# EAGLE schematic OOBD-Cup_v6 (EAGLE 6.4)

## Sheet 1 of 3
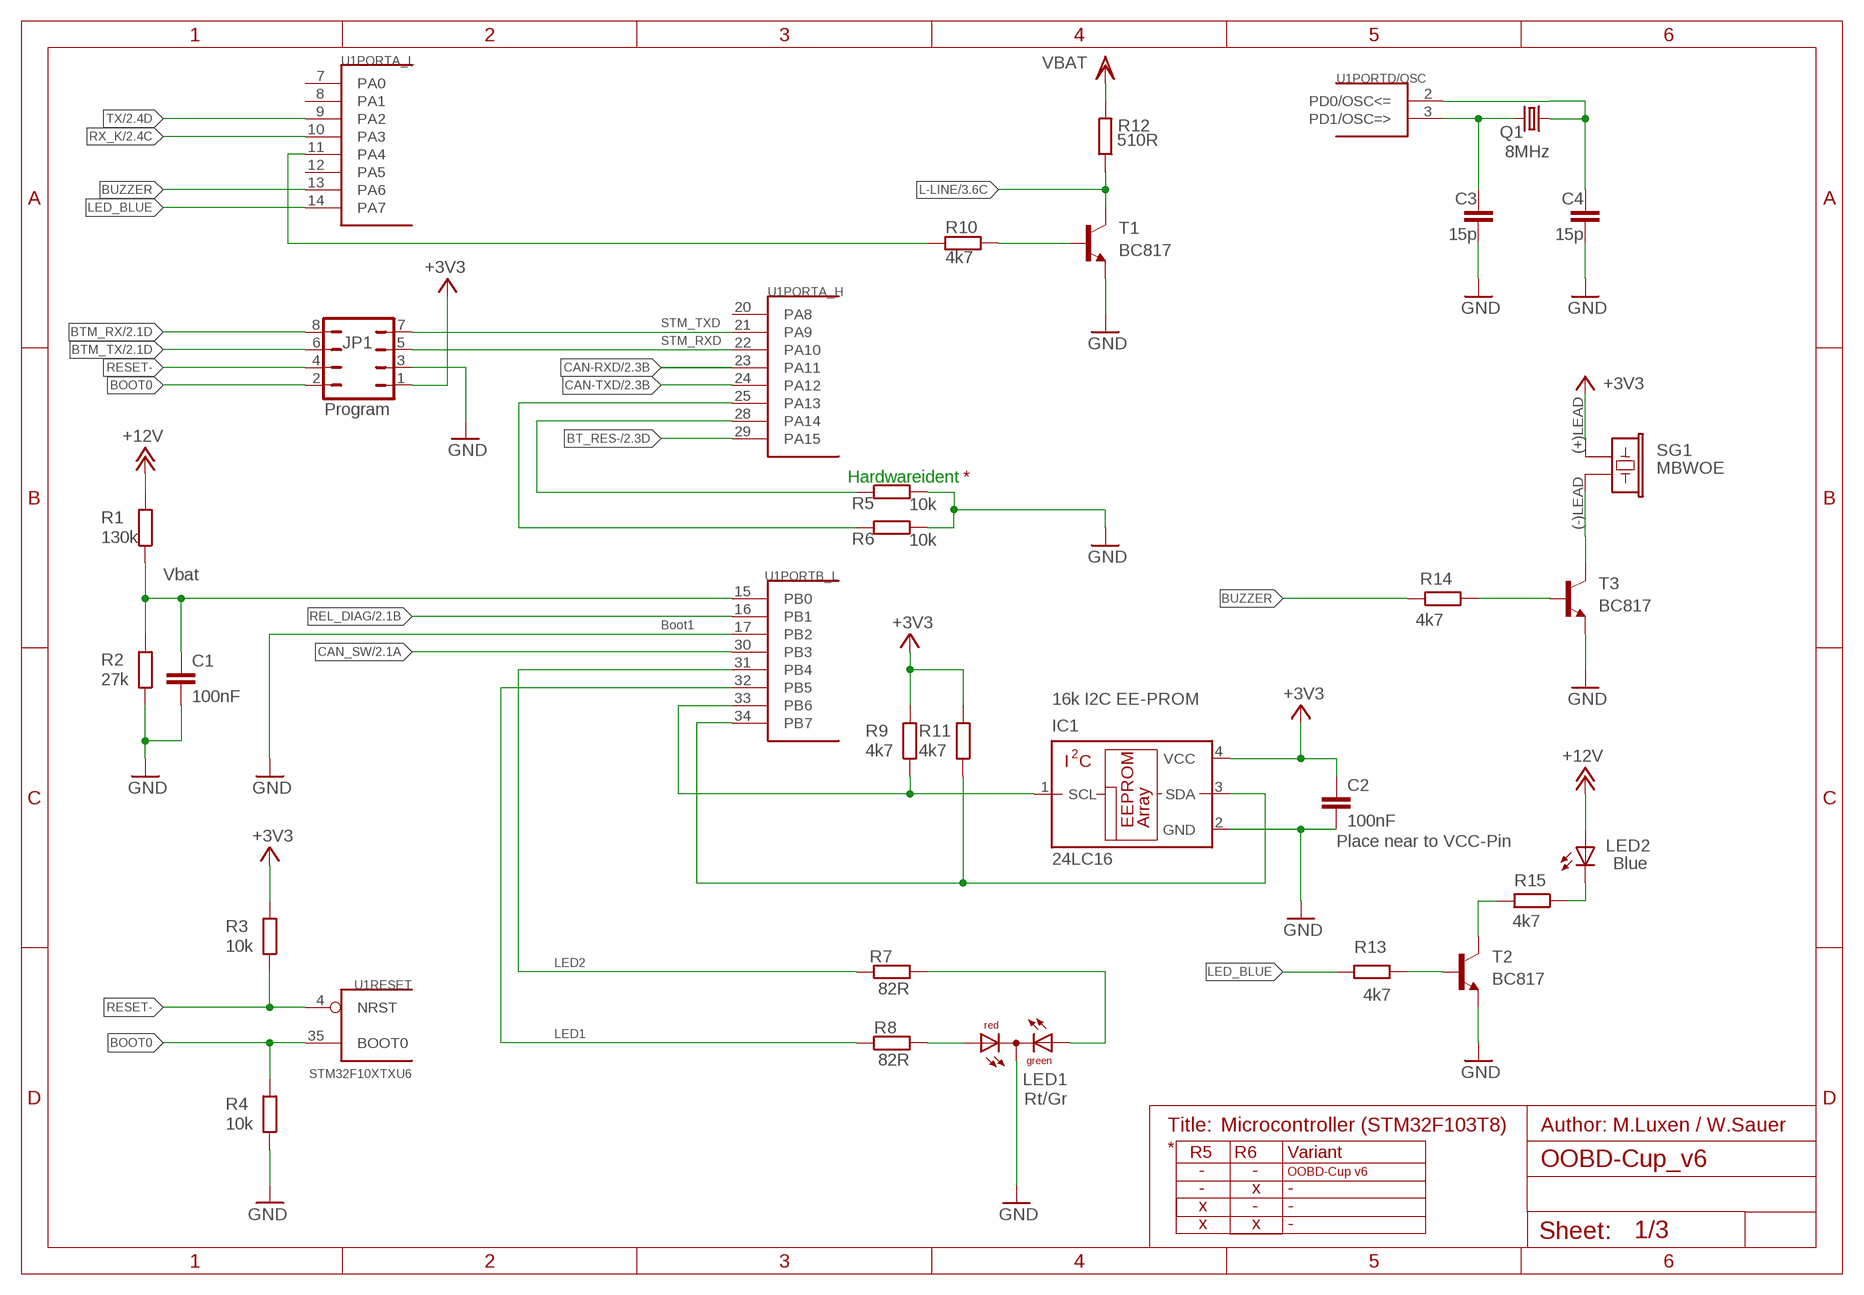
[diagram p0: schematic, sheet 1]

### Parts
C1  100nF  C-EUC0603  [C0603]
C2  100nF  C-EUC0603  [C0603]
C3  15p  C-EUC0603  [C0603]
C4  15p  C-EUC0603  [C0603]
IC1  24LC16  24LC00OT  [SOT23-5L]
JP1  Program  JP4Q  [JP4Q]
LED1  Rt/Gr  DUOLED2X5  [DUOLED2X5]
LED2  Blue  LEDSQR5.7X3.2  [U57X32]
Q1  8MHz  CRYSTALCTS406  [CTS406]
R1  130k  R-EU_R0603  [R0603]
R2  27k  R-EU_R0603  [R0603]
R3  10k  R-EU_R0603  [R0603]
R4  10k  R-EU_R0603  [R0603]
R5  10k  R-EU_R0603  [R0603]
R6  10k  R-EU_R0603  [R0603]
R7  82R  R-EU_R0603  [R0603]
R8  82R  R-EU_R0603  [R0603]
R9  4k7  R-EU_R0603  [R0603]
R10  4k7  R-EU_R0603  [R0603]
R11  4k7  R-EU_R0603  [R0603]
R12  510R  R-EU_R0603  [R0603]
R13  4k7  R-EU_R0603  [R0603]
R14  4k7  R-EU_R0603  [R0603]
R15  4k7  R-EU_R0603  [R0603]
SG1  MBWOE  [BME0603SA]
T1  BC817  BC847  [SOT23]
T2  BC817  BC847  [SOT23]
T3  BC817  BC847  [SOT23]
U1  STM32F10XTXU6  [VFQFPN36]

### Nets
+3V3: C2.1 IC1.4(VCC) JP1.1 R3.2 R9.2 R11.2 SG1.(+)LEAD ; also sheet 2,3
+12V: LED2.A R1.2 ; also sheet 2,3
BOOT0: JP1.2 R4.2 U1.35(RESET:BOOT0)
BT_RES-: U1.29(PORTA_H:PA15) ; also sheet 2
BTM_RX: JP1.8 ; also sheet 2
BTM_TX: JP1.6 ; also sheet 2
BUZZER: R14.1 U1.13(PORTA_L:PA6)
CAN-RXD: U1.23(PORTA_H:PA11) ; also sheet 2
CAN-TXD: U1.24(PORTA_H:PA12) ; also sheet 2
CAN_SW: U1.30(PORTB_L:PB3) ; also sheet 2
GND: C1.2 C2.2 C3.1 C4.1 IC1.2(GND) JP1.3 LED1.K(C) R2.1 R4.1 R5.2 R6.2 T1.2(E) T2.2(E) T3.2(E) U1.17(PORTB_L:PB2) ; also sheet 2,3
L-LINE: R12.1 T1.3(C) ; also sheet 3
LED1: R8.1 U1.32(PORTB_L:PB5)
LED2: R7.1 U1.31(PORTB_L:PB4)
LED_BLUE: R13.1 U1.14(PORTA_L:PA7)
MODE1: R6.1 U1.25(PORTA_H:PA13)
N$1: C4.2 Q1.1 U1.2(PORTD/OSC:PD0/OSC<=)
N$2: C3.2 Q1.3 U1.3(PORTD/OSC:PD1/OSC=>)
N$4: LED1.AR R8.2
N$6: LED1.AG R7.2
N$7: LED2.K(C) R15.1
N$8: R10.1 U1.11(PORTA_L:PA4)
N$9: R13.2 T2.1(B)
N$10: R15.2 T2.3(C)
N$15: C1.1 R1.1 R2.2 U1.15(PORTB_L:PB0)
N$17: R10.2 T1.1(B)
N$18: R5.1 U1.28(PORTA_H:PA14)
N$19: IC1.1(SCL) R9.1 U1.33(PORTB_L:PB6)
N$21: IC1.3(SDA) R11.1 U1.34(PORTB_L:PB7)
N$23: SG1.(-)LEAD T3.3(C)
N$24: R14.2 T3.1(B)
REL_DIAG: U1.16(PORTB_L:PB1) ; also sheet 2
RESET-: JP1.4 R3.1 U1.4(RESET:NRST)
RX_K: U1.10(PORTA_L:PA3) ; also sheet 2
STM_RXD: JP1.5 U1.22(PORTA_H:PA10)
STM_TXD: JP1.7 U1.21(PORTA_H:PA9)
TX: U1.9(PORTA_L:PA2) ; also sheet 2
VBAT: R12.2 ; also sheet 2,3
Unconnected: U1.7(PORTA_L:PA0) U1.8(PORTA_L:PA1) U1.12(PORTA_L:PA5) U1.20(PORTA_H:PA8)

### Notes on the sheet
- Hardwareident | *
- Vbat
- Boot1
- 16k I2C EE-PROM
- Place near to VCC-Pin
- Title: | Microcontroller (STM32F103T8) | Author: M.Luxen / W.Sauer
- * | R5 | R6 | Variant
- - | - | OOBD-Cup v6
- - | x | -
- x | - | -
- x | x | -

## Sheet 2 of 3
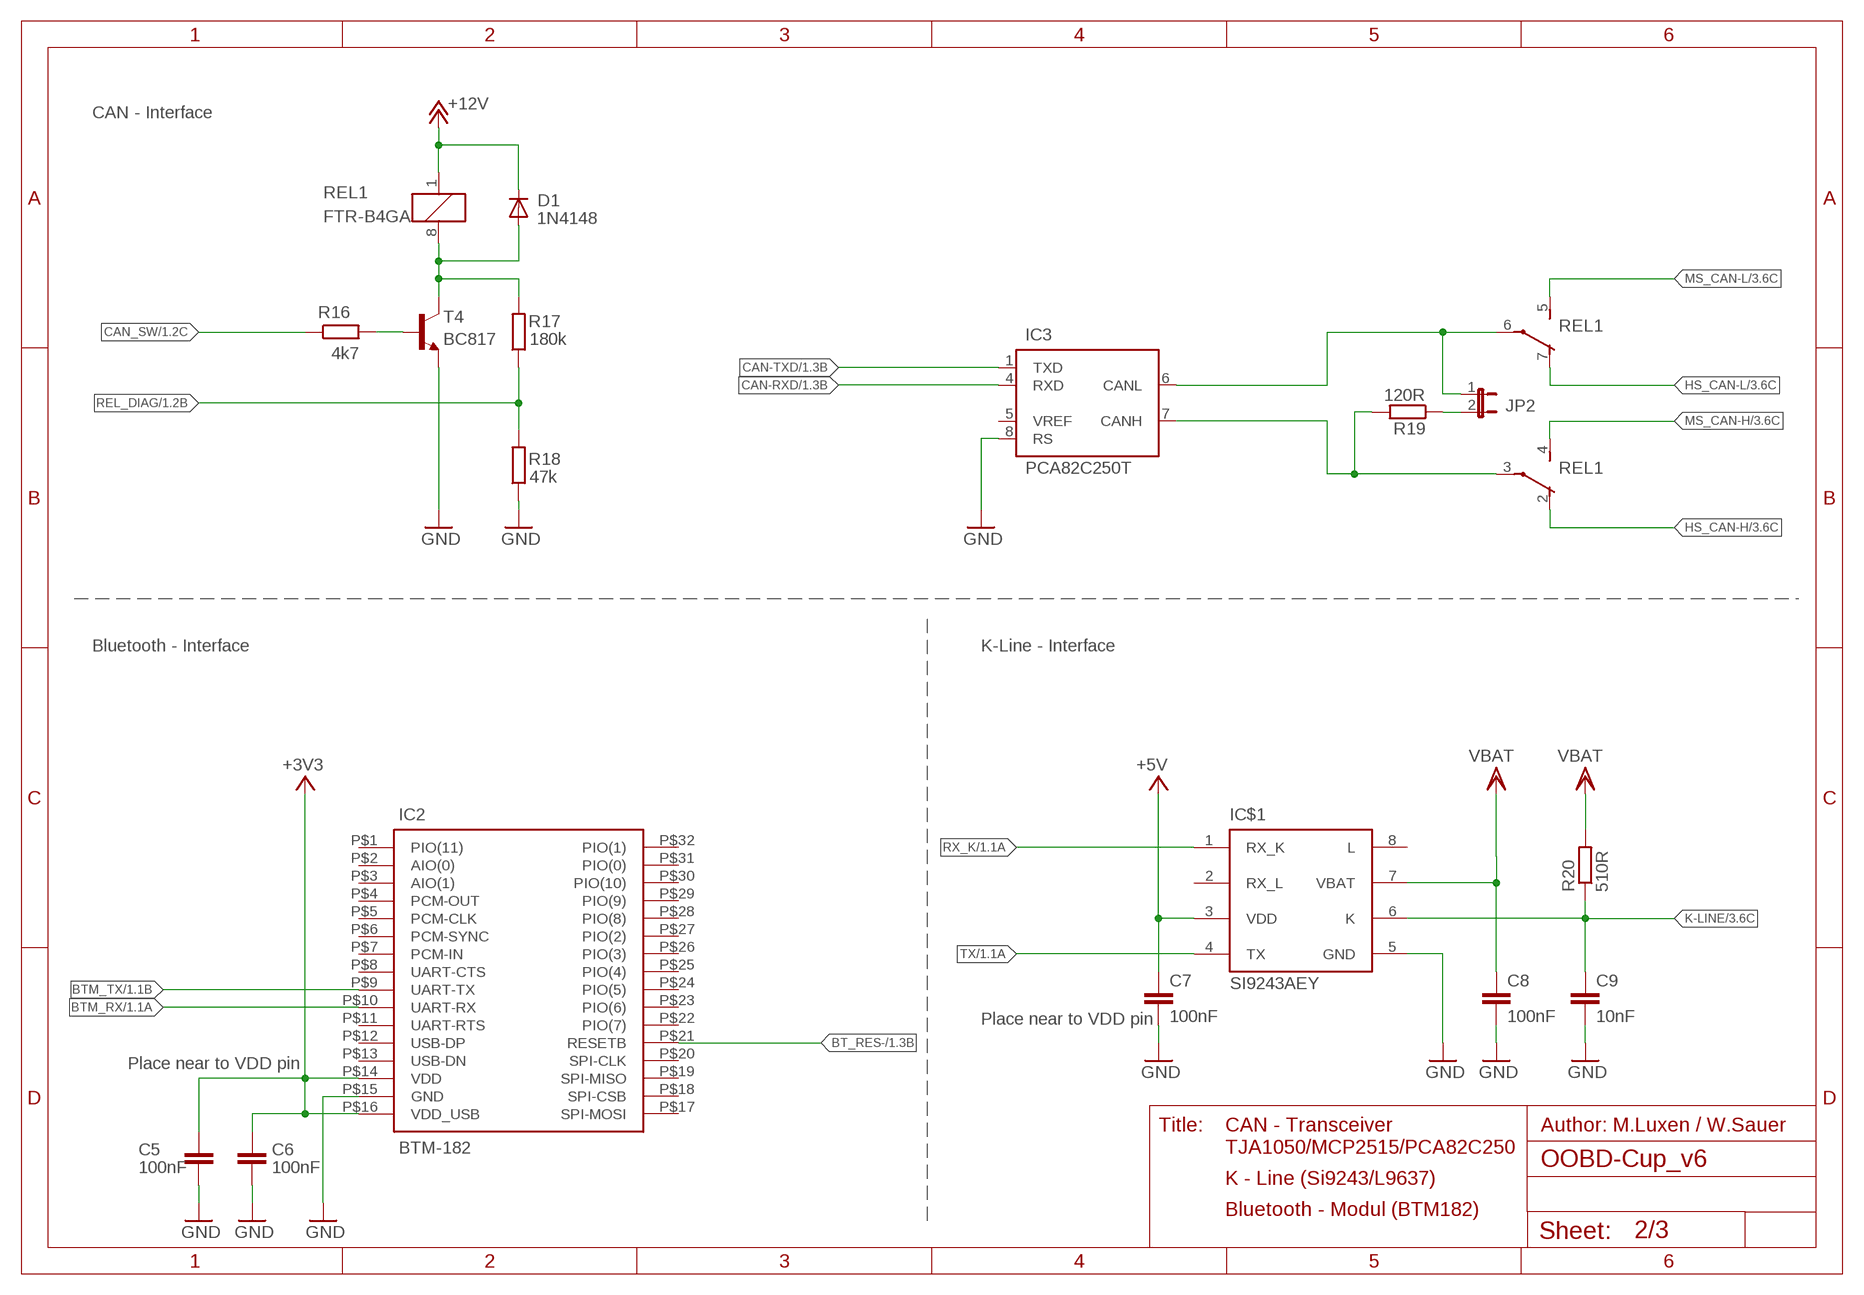
[diagram p1: schematic, sheet 2]

### Parts
C5  100nF  C-EUC0603  [C0603]
C6  100nF  C-EUC0603  [C0603]
C7  100nF  C-EUC0603  [C0603]
C8  100nF  C-EUC0603  [C0603]
C9  10nF  C-EUC0603  [C0603]
D1  1N4148  DIODE-MINIMELF  [MINIMELF]
IC2  BTM-182  [BTM-182]
IC3  PCA82C250T  [SO08]
IC$1  SI9243AEY  [SO08]
JP2  JP1E  [JP1]
R16  4k7  R-EU_R0603  [R0603]
R17  180k  R-EU_R0603  [R0603]
R18  47k  R-EU_R0603  [R0603]
R19  120R  R-EU_R0603  [R0603]
R20  510R  R-EU_R0603  [R0603]
REL1  FTR-B4GA  [FTR-B4GA]
T4  BC817  BC847  [SOT23]

### Nets
+3V3: C5.1 C6.1 IC2.P$14(VDD) IC2.P$16(VDD_USB) ; also sheet 1,3
+5V: C7.1 IC$1.3(VDD) ; also sheet 3
+12V: D1.C REL1.1 ; also sheet 1,3
BT_RES-: IC2.P$21(RESETB) ; also sheet 1
BTM_RX: IC2.P$10(UART-RX) ; also sheet 1
BTM_TX: IC2.P$9(UART-TX) ; also sheet 1
CAN-RXD: IC3.4(RXD) ; also sheet 1
CAN-TXD: IC3.1(TXD) ; also sheet 1
CAN_SW: R16.1 ; also sheet 1
GND: C5.2 C6.2 C7.2 C8.2 C9.2 IC2.P$15(GND) IC3.8(RS) IC$1.5(GND) R18.1 T4.2(E) ; also sheet 1,3
HS_CAN-H: REL1.2(O) ; also sheet 3
HS_CAN-L: REL1.7(O) ; also sheet 3
K-LINE: C9.1 IC$1.6(K) R20.1 ; also sheet 3
MS_CAN-H: REL1.4(S) ; also sheet 3
MS_CAN-L: REL1.5(S) ; also sheet 3
N$3: IC3.6(CANL) JP2.1 REL1.6(P)
N$5: IC3.7(CANH) R19.2 REL1.3(P)
N$16: JP2.2 R19.1
N$20: R16.2 T4.1(B)
N$27: D1.A R17.2 REL1.8 T4.3(C)
REL_DIAG: R17.1 R18.2 ; also sheet 1
RX_K: IC$1.1(RX_K) ; also sheet 1
TX: IC$1.4(TX) ; also sheet 1
VBAT: C8.1 IC$1.7(VBAT) R20.2 ; also sheet 1,3
Unconnected: IC2.P$1(PIO(11)) IC2.P$2(AIO(0)) IC2.P$3(AIO(1)) IC2.P$4(PCM-OUT) IC2.P$5(PCM-CLK) IC2.P$6(PCM-SYNC) IC2.P$7(PCM-IN) IC2.P$8(UART-CTS) IC2.P$11(UART-RTS) IC2.P$12(USB-DP) IC2.P$13(USB-DN) IC2.P$17(SPI-MOSI) IC2.P$18(SPI-CSB) IC2.P$19(SPI-MISO) IC2.P$20(SPI-CLK) IC2.P$22(PIO(7)) IC2.P$23(PIO(6)) IC2.P$24(PIO(5)) IC2.P$25(PIO(4)) IC2.P$26(PIO(3)) IC2.P$27(PIO(2)) IC2.P$28(PIO(8)) IC2.P$29(PIO(9)) IC2.P$30(PIO(10)) IC2.P$31(PIO(0)) IC2.P$32(PIO(1)) IC3.5(VREF) IC$1.2(RX_L) IC$1.8(L)

### Notes on the sheet
- CAN - Interface
- Bluetooth - Interface | K-Line - Interface
- Place near to VDD pin
- Place near to VDD pin
- Title: | CAN - Transceiver | Author: M.Luxen / W.Sauer
- TJA1050/MCP2515/PCA82C250
- K - Line (Si9243/L9637)
- Bluetooth - Modul (BTM182)

## Sheet 3 of 3
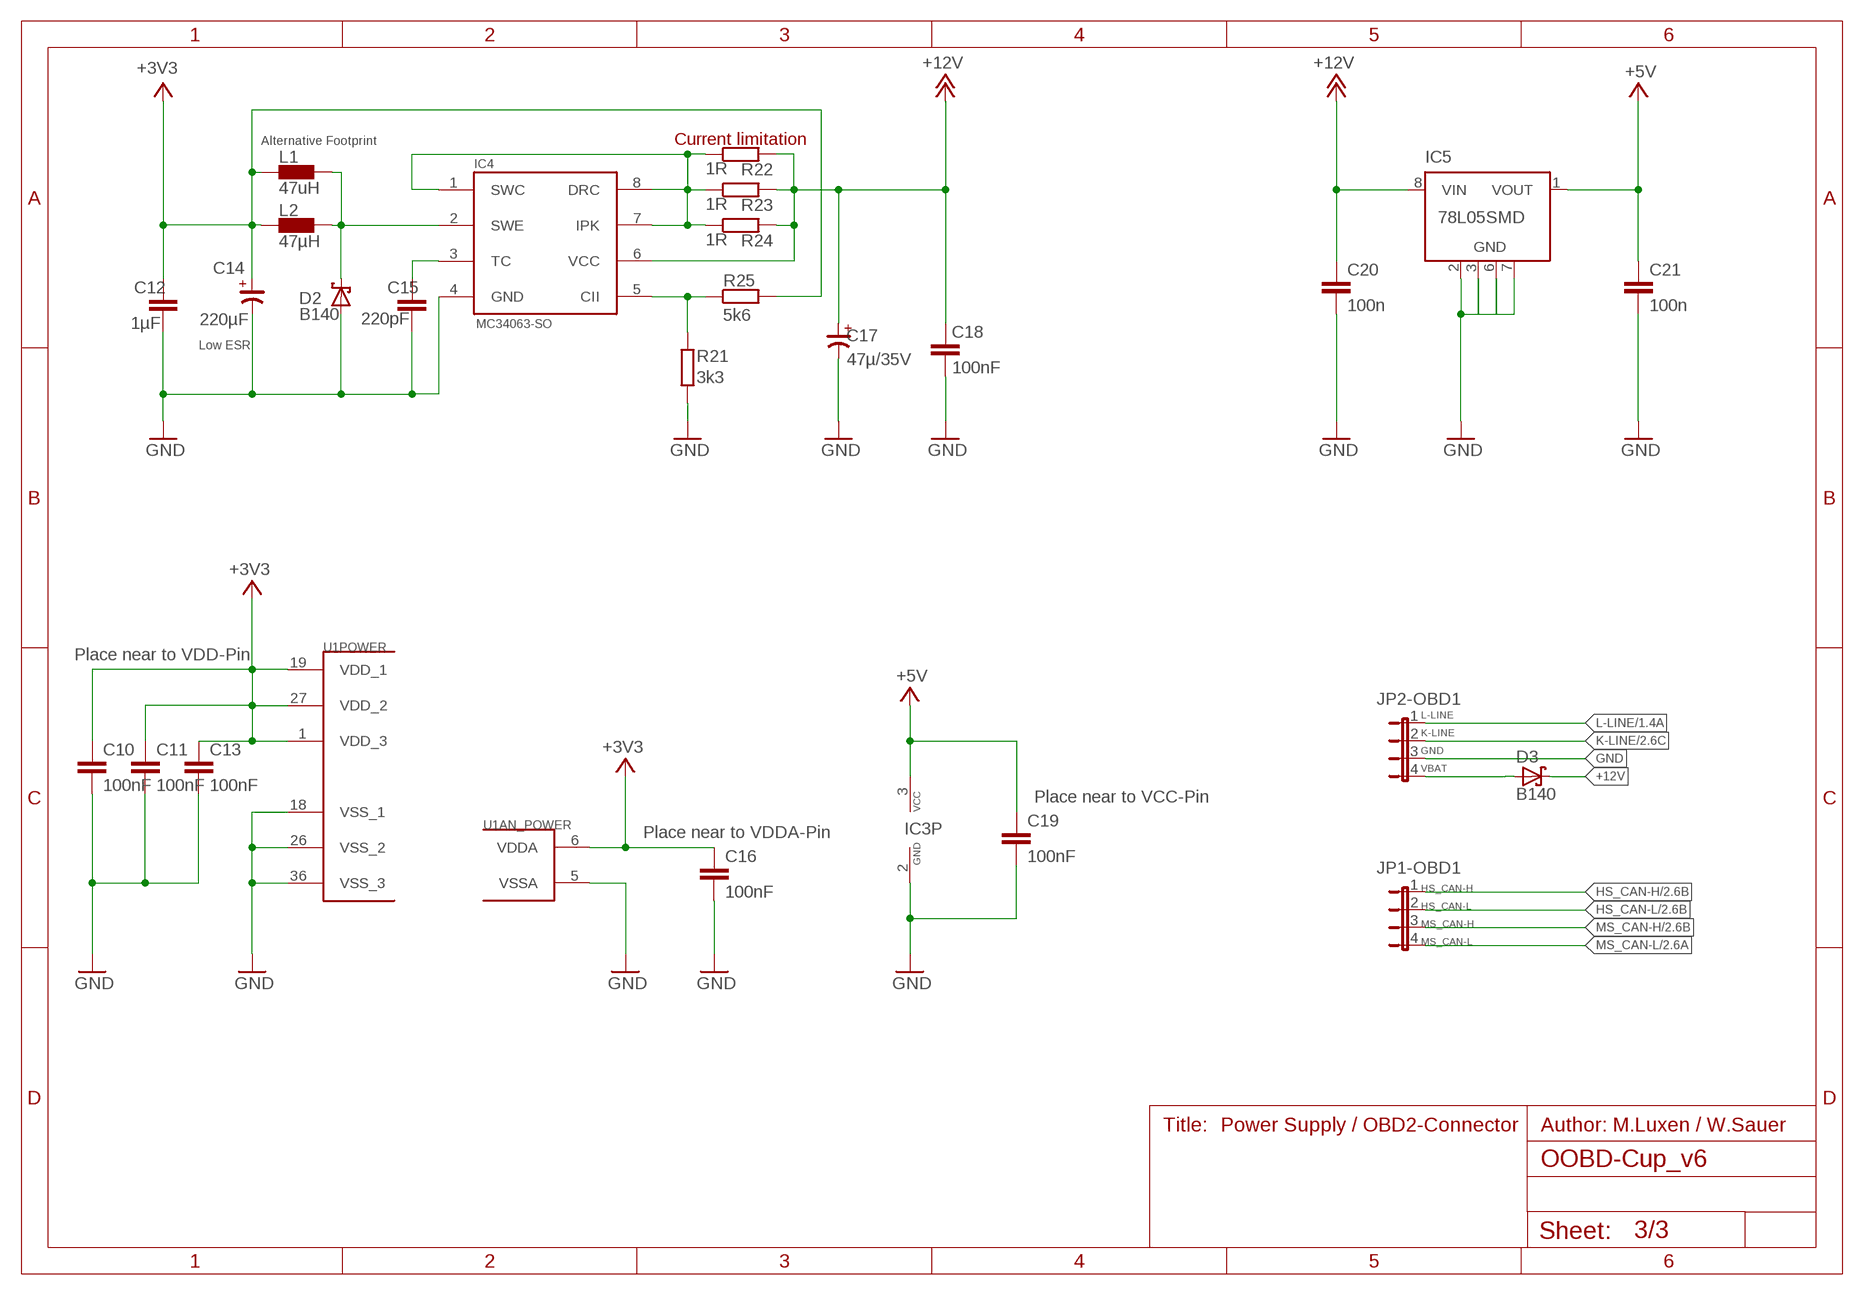
[diagram p2: schematic, sheet 3]

### Parts
C10  100nF  C-EUC0603  [C0603]
C11  100nF  C-EUC0603  [C0603]
C12  1µF  C-EUC0603K  [C0603K]
C13  100nF  C-EUC0603  [C0603]
C14  220µF  CP_6032-TE-C  [C6032-TE-C]
C15  220pF  C-EUC0603K  [C0603K]
C16  100nF  C-EUC0603  [C0603]
C17  47µ/35V  CP-SV-D  [SV-D]
C18  100nF  C-EUC0603K  [C0603K]
C19  100nF  C-EUC0603  [C0603]
C20  100n  C-EUC0603  [C0603]
C21  100n  C-EUC0603  [C0603]
D2  B140  SCHOTTKY-DIODESMD  [SMB]
D3  B140  SCHOTTKY-DIODESMD  [SMB]
IC4  MC34063-SO  [SO8]
IC5  78L05SMD  [SO08]
JP1-OBD1  JP4E  [JP4]
JP2-OBD1  JP4E  [JP4]
L1  47uH  PIS2408  [PIS2408]
L2  47µH  07HCP-XXXX-50  [07HCP-XXXX-50]
R21  3k3  R-EU_R0603  [R0603]
R22  1R  R-EU_R0805  [R0805]
R23  1R  R-EU_R0805  [R0805]
R24  1R  R-EU_R0805  [R0805]
R25  5k6  R-EU_R0603  [R0603]

### Nets
+3V3: C10.1 C11.1 C12.1 C13.1 C14.+ C16.1 L1.P$1 L2.1 R25.2 U1.1(POWER:VDD_3) U1.6(AN_POWER:VDDA) U1.19(POWER:VDD_1) U1.27(POWER:VDD_2) ; also sheet 1,2
+5V: C19.1 C21.1 IC3.3(VCC) IC5.1(VOUT) ; also sheet 2
+12V: C17.+ C18.1 C20.1 D3.C IC4.6(VCC) IC5.8(VIN) R22.2 R23.2 R24.2 ; also sheet 1,2
GND: C10.2 C11.2 C12.2 C13.2 C14.- C15.2 C16.2 C17.- C18.2 C19.2 C20.2 C21.2 D2.A IC3.2(GND) IC4.4(GND) IC5.2(GND) IC5.3(GND) IC5.6(GND) IC5.7(GND) JP2-OBD1.3 R21.2 U1.5(AN_POWER:VSSA) U1.18(POWER:VSS_1) U1.26(POWER:VSS_2) U1.36(POWER:VSS_3) ; also sheet 1,2
HS_CAN-H: JP1-OBD1.1 ; also sheet 2
HS_CAN-L: JP1-OBD1.2 ; also sheet 2
K-LINE: JP2-OBD1.2 ; also sheet 2
L-LINE: JP2-OBD1.1 ; also sheet 1
MS_CAN-H: JP1-OBD1.3 ; also sheet 2
MS_CAN-L: JP1-OBD1.4 ; also sheet 2
N$11: C15.1 IC4.3(TC)
N$12: IC4.1(SWC) IC4.7(IPK) IC4.8(DRC) R22.1 R23.1 R24.1
N$13: IC4.5(CII) R21.1 R25.1
N$14: D2.C IC4.2(SWE) L1.P$2 L2.2
VBAT: D3.A JP2-OBD1.4 ; also sheet 1,2
Unconnected: IC5.4(NC) IC5.5(NC)

### Notes on the sheet
- Alternative Footprint | Current limitation
- Low ESR
- Place near to VDD-Pin
- Place near to VCC-Pin
- Place near to VDDA-Pin
- Title: | Power Supply / OBD2-Connector | Author: M.Luxen / W.Sauer

## Library data of the parts
C1 C3 C4 C7-C11 C13 C16 C19-C21 = resistor:C-EU: CAPACITOR, European symbol
C2 C5 C6 C12 C15 C18 = rcl:C-EU: CAPACITOR, European symbol
C14 = rc-master:CP_: POLARIZED CAP
C17 = cap-master:CP-: POLARIZED CAP
D1 = diode:DIODE-: DIODE
D2 D3 = diode:SCHOTTKY-DIODE: Schottky Diode
IC1 = microchip:24*00: Serial EEPROM 128 bit, I2C (AA = 1.8 V/LC = 2.5 V/C = 5.0 V); MF: MICROCHIP; MPN: 24LC00T-I/OT; OC_FARNELL: 9757864; OC_NEWARK: 62K0574
IC2 = BTM182:BTM-182: Rayson BTM-182 Bluetooth Modul all Pins
IC3 = can:PCA82C250: PCA82C250 CAN Transceiver, Philips
IC4 = mc34063:MC34063-SO: DC/DC converter MC34063 in SO08.
IC5 = linear:78L*SMD: Positive VOLTAGE REGULATOR
IC$1 = Vishay_ISO9141:SI9243AEY
JP1 = jumper:JP4Q: JUMPER
JP1-OBD1 JP2-OBD1 = jumper:JP4E: JUMPER
JP2 = jumper:JP1E: JUMPER
L1 = Inductor-Fastron:PIS2408: Fastron SMD Power Inductors Source: http://www.fastrongroup.com/series/47/findProducts
L2 = Inductor-Fastron:07HCP-XXXX-50: Fastron 07HCP series (with tube) Plugable inductors (shielded) Source: http://www.fastrongroup.com
LED1 = led:DUOLED2X5: DUO LED 2 colors, 2.5 x 5 mm, recangle
LED2 = led:LED: LED OSRAM: - CHIPLED LG R971, LG N971, LY N971, LG Q971, LY Q971, LO R971, LY R971 LH N974, LH R974 LS Q976, LO Q976, LY Q976 LO Q996 - Hyper CHIPLED LW Q18S LB Q993, LB Q99A, LB R99A - SideLED LS A670, LO A670, LY A670, LG A670, LP A670 LB A673, LV A673, LT A673, LW A673 LH A674 LY A675 LS A676, LA A676, LO A676, LY A676, LW A676 LS A679, LY A679, LG A679 - Hyper Micro SIDELED® LS Y876, LA Y876, LO Y876, LY Y876 LT Y87S - SmartLED LW L88C, LW L88S LB L89C, LB L89S, LG L890 LS L89K, LO L89K, LY L89K LS L896, LA L896, LO L896, LY L896 - TOPLED LS T670, LO T670, LY T670, LG T670, LP T670 LSG T670, LSP T670, LSY T670, LOP T670, LYG T670 LG T671, LOG T671, LSG T671 LB T673, LV T673, LT T673, LW T673 LH T674 LS T676, LA T676, LO T676, LY T676, LB T676, LH T676, LSB T676, LW T676 LB T67C, LV T67C, LT T67C, LS T67K, LO T67K, LY T67K, LW E67C LS E67B, LA E67B, LO E67B, LY E67B, LB E67C, LV E67C, LT E67C LW T67C LS T679, LY T679, LG T679 LS T770, LO T770, LY T770, LG T770, LP T770 LB T773, LV T773, LT T773, LW T773 LH T774 LS E675, LA E675, LY E675, LS T675 LS T776, LA T776, LO T776, LY T776, LB T776 LHGB T686 LT T68C, LB T68C - Hyper Mini TOPLED® LB M676 - Mini TOPLED Santana® LG M470 LS M47K, LO M47K, LY M47K Source: http://www.osram.convergy.de LUXEON: - LUMILED® LXK2-PW12-R00, LXK2-PW12-S00, LXK2-PW14-U00, LXK2-PW14-V00 LXK2-PM12-R00, LXK2-PM12-S00, LXK2-PM14-U00 LXK2-PE12-Q00, LXK2-PE12-R00, LXK2-PE12-S00, LXK2-PE14-T00, LXK2-PE14-U00 LXK2-PB12-K00, LXK2-PB12-L00, LXK2-PB12-M00, LXK2-PB14-N00, LXK2-PB14-P00, LXK2-PB14-Q00 LXK2-PR12-L00, LXK2-PR12-M00, LXK2-PR14-Q00, LXK2-PR14-R00 LXK2-PD12-Q00, LXK2-PD12-R00, LXK2-PD12-S00 LXK2-PH12-R00, LXK2-PH12-S00 LXK2-PL12-P00, LXK2-PL12-Q00, LXK2-PL12-R00 Source: www.luxeon.com KINGBRIGHT: KA-3528ASYC Source: www.kingbright.com
Q1 = crystal:CRYSTAL: CRYSTAL; OC_FARNELL: unknown; OC_NEWARK: unknown
R1-R4 R9 R11 R19 R20 = resistor:R-EU_: RESISTOR, European symbol
R5-R8 R10 R12-R18 R21-R25 = rcl:R-EU_: RESISTOR, European symbol
REL1 = relay:FTR-B4: Fujitsu FTR-B4 Series Ultra Miniature 2-Poles 2A (SLIM PROFILE SIGNAL RELAY); MN: Fujitsu; MPN: FTR-B4GAxxxZ; OC_REICHELT: FTR-B4GA 12V
SG1 = buzzer:MBWOE: Buzzer SMD Miniaturbuzzer; MF: Grewus
T1-T4 = transistor:BC847: NPN TRANSISTOR
U1 = stm32:STM32F10XTXU6: STM32F101/103 36pad VFQPFN36